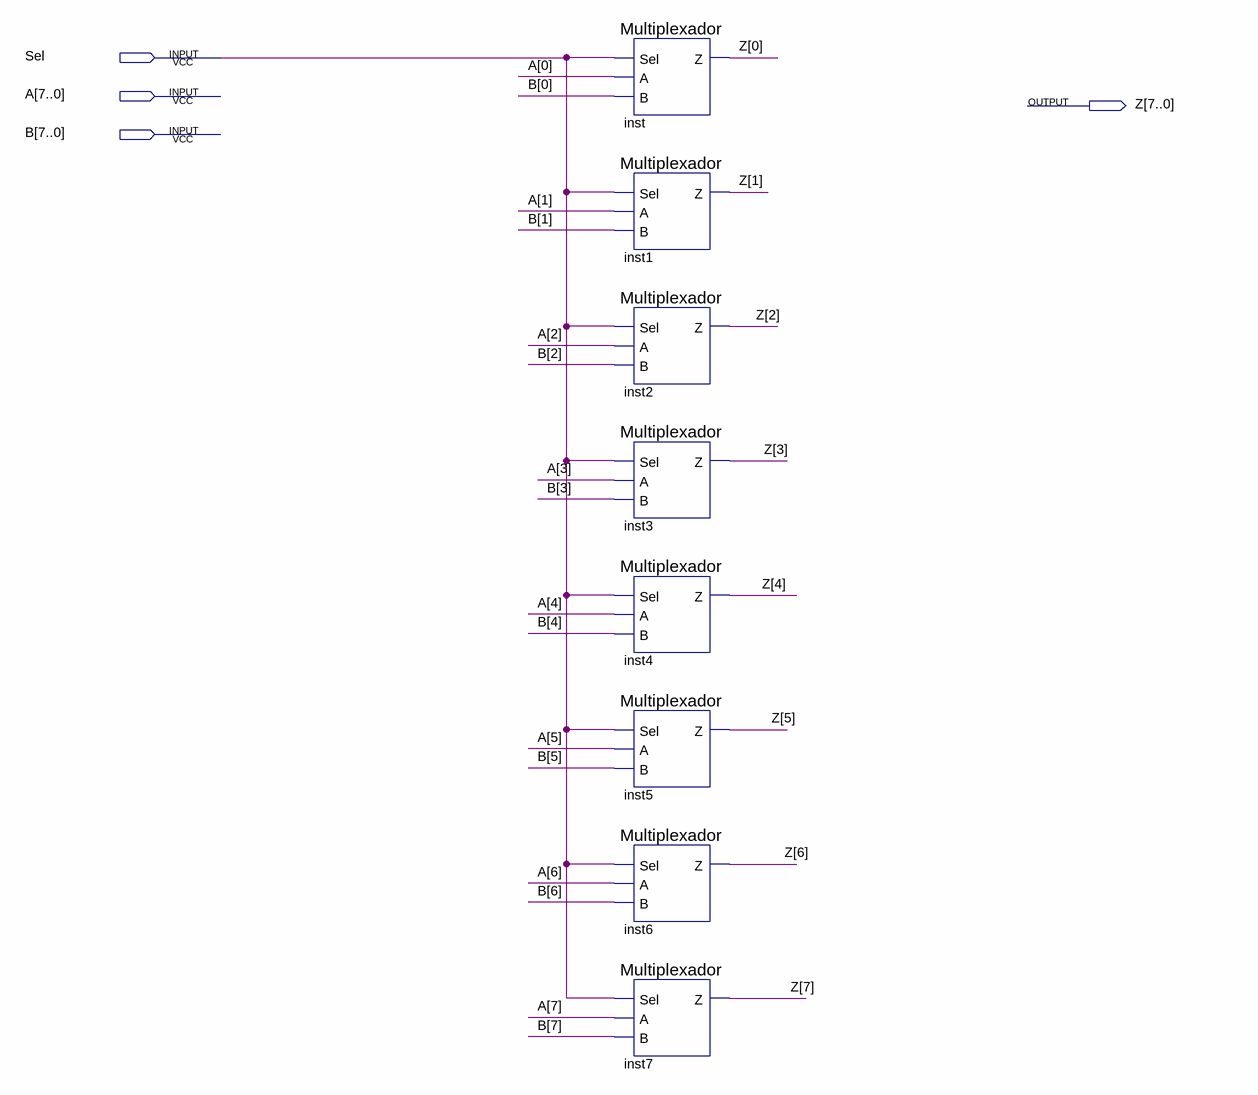
[diagram p0: schematic sheet]
// Quartus schematic Mux8bit.bdf as structural Verilog: 8 symbols, 4 pins
module Mux8bit (
  input  Sel,
  input  [7:0] A,
  input  [7:0] B,
  output [7:0] Z
);

  Multiplexador inst (.Sel(Sel), .A(A[0]), .B(B[0]), .Z(Z[0]));
  Multiplexador inst1 (.Sel(Sel), .A(A[1]), .B(B[1]), .Z(Z[1]));
  Multiplexador inst2 (.Sel(Sel), .A(A[2]), .B(B[2]), .Z(Z[2]));
  Multiplexador inst3 (.Sel(Sel), .A(A[3]), .B(B[3]), .Z(Z[3]));
  Multiplexador inst4 (.Sel(Sel), .A(A[4]), .B(B[4]), .Z(Z[4]));
  Multiplexador inst5 (.Sel(Sel), .A(A[5]), .B(B[5]), .Z(Z[5]));
  Multiplexador inst6 (.Sel(Sel), .A(A[6]), .B(B[6]), .Z(Z[6]));
  Multiplexador inst7 (.Sel(Sel), .A(A[7]), .B(B[7]), .Z(Z[7]));
endmodule
